# Altium schematic sheet 0042_PCH_PI_BOM.SchDoc
size 848 x 558 mm
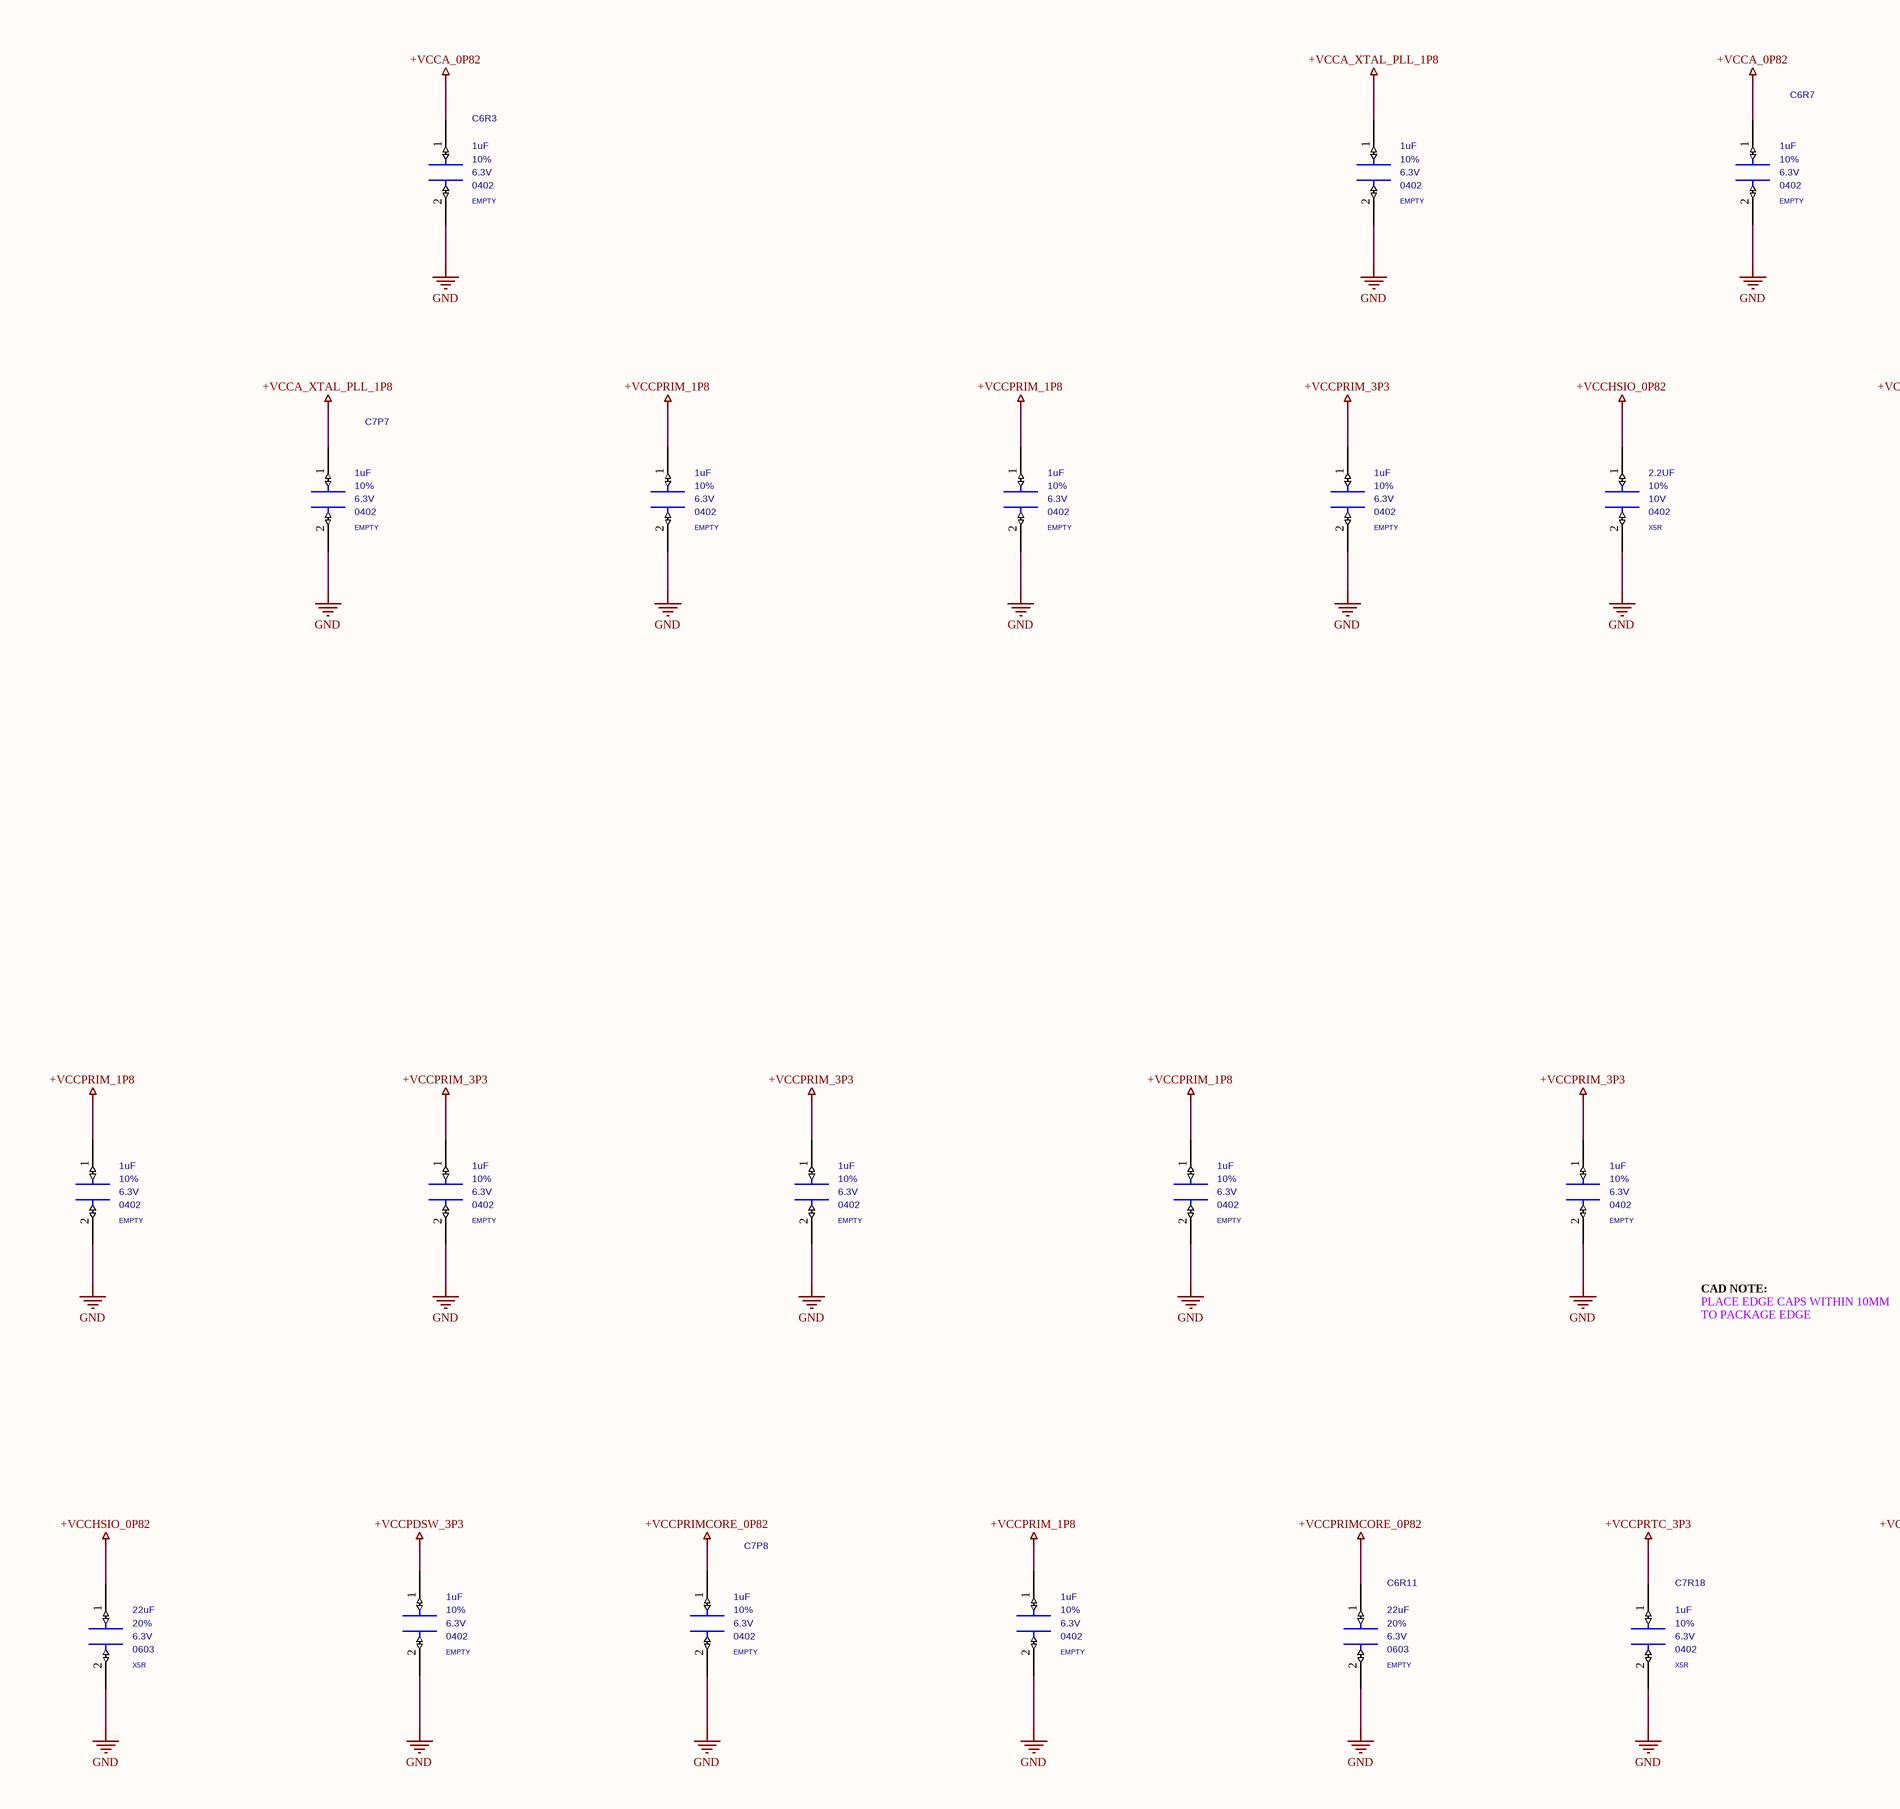
[diagram p0: 0042_PCH_PI_BOM.SchDoc, left]
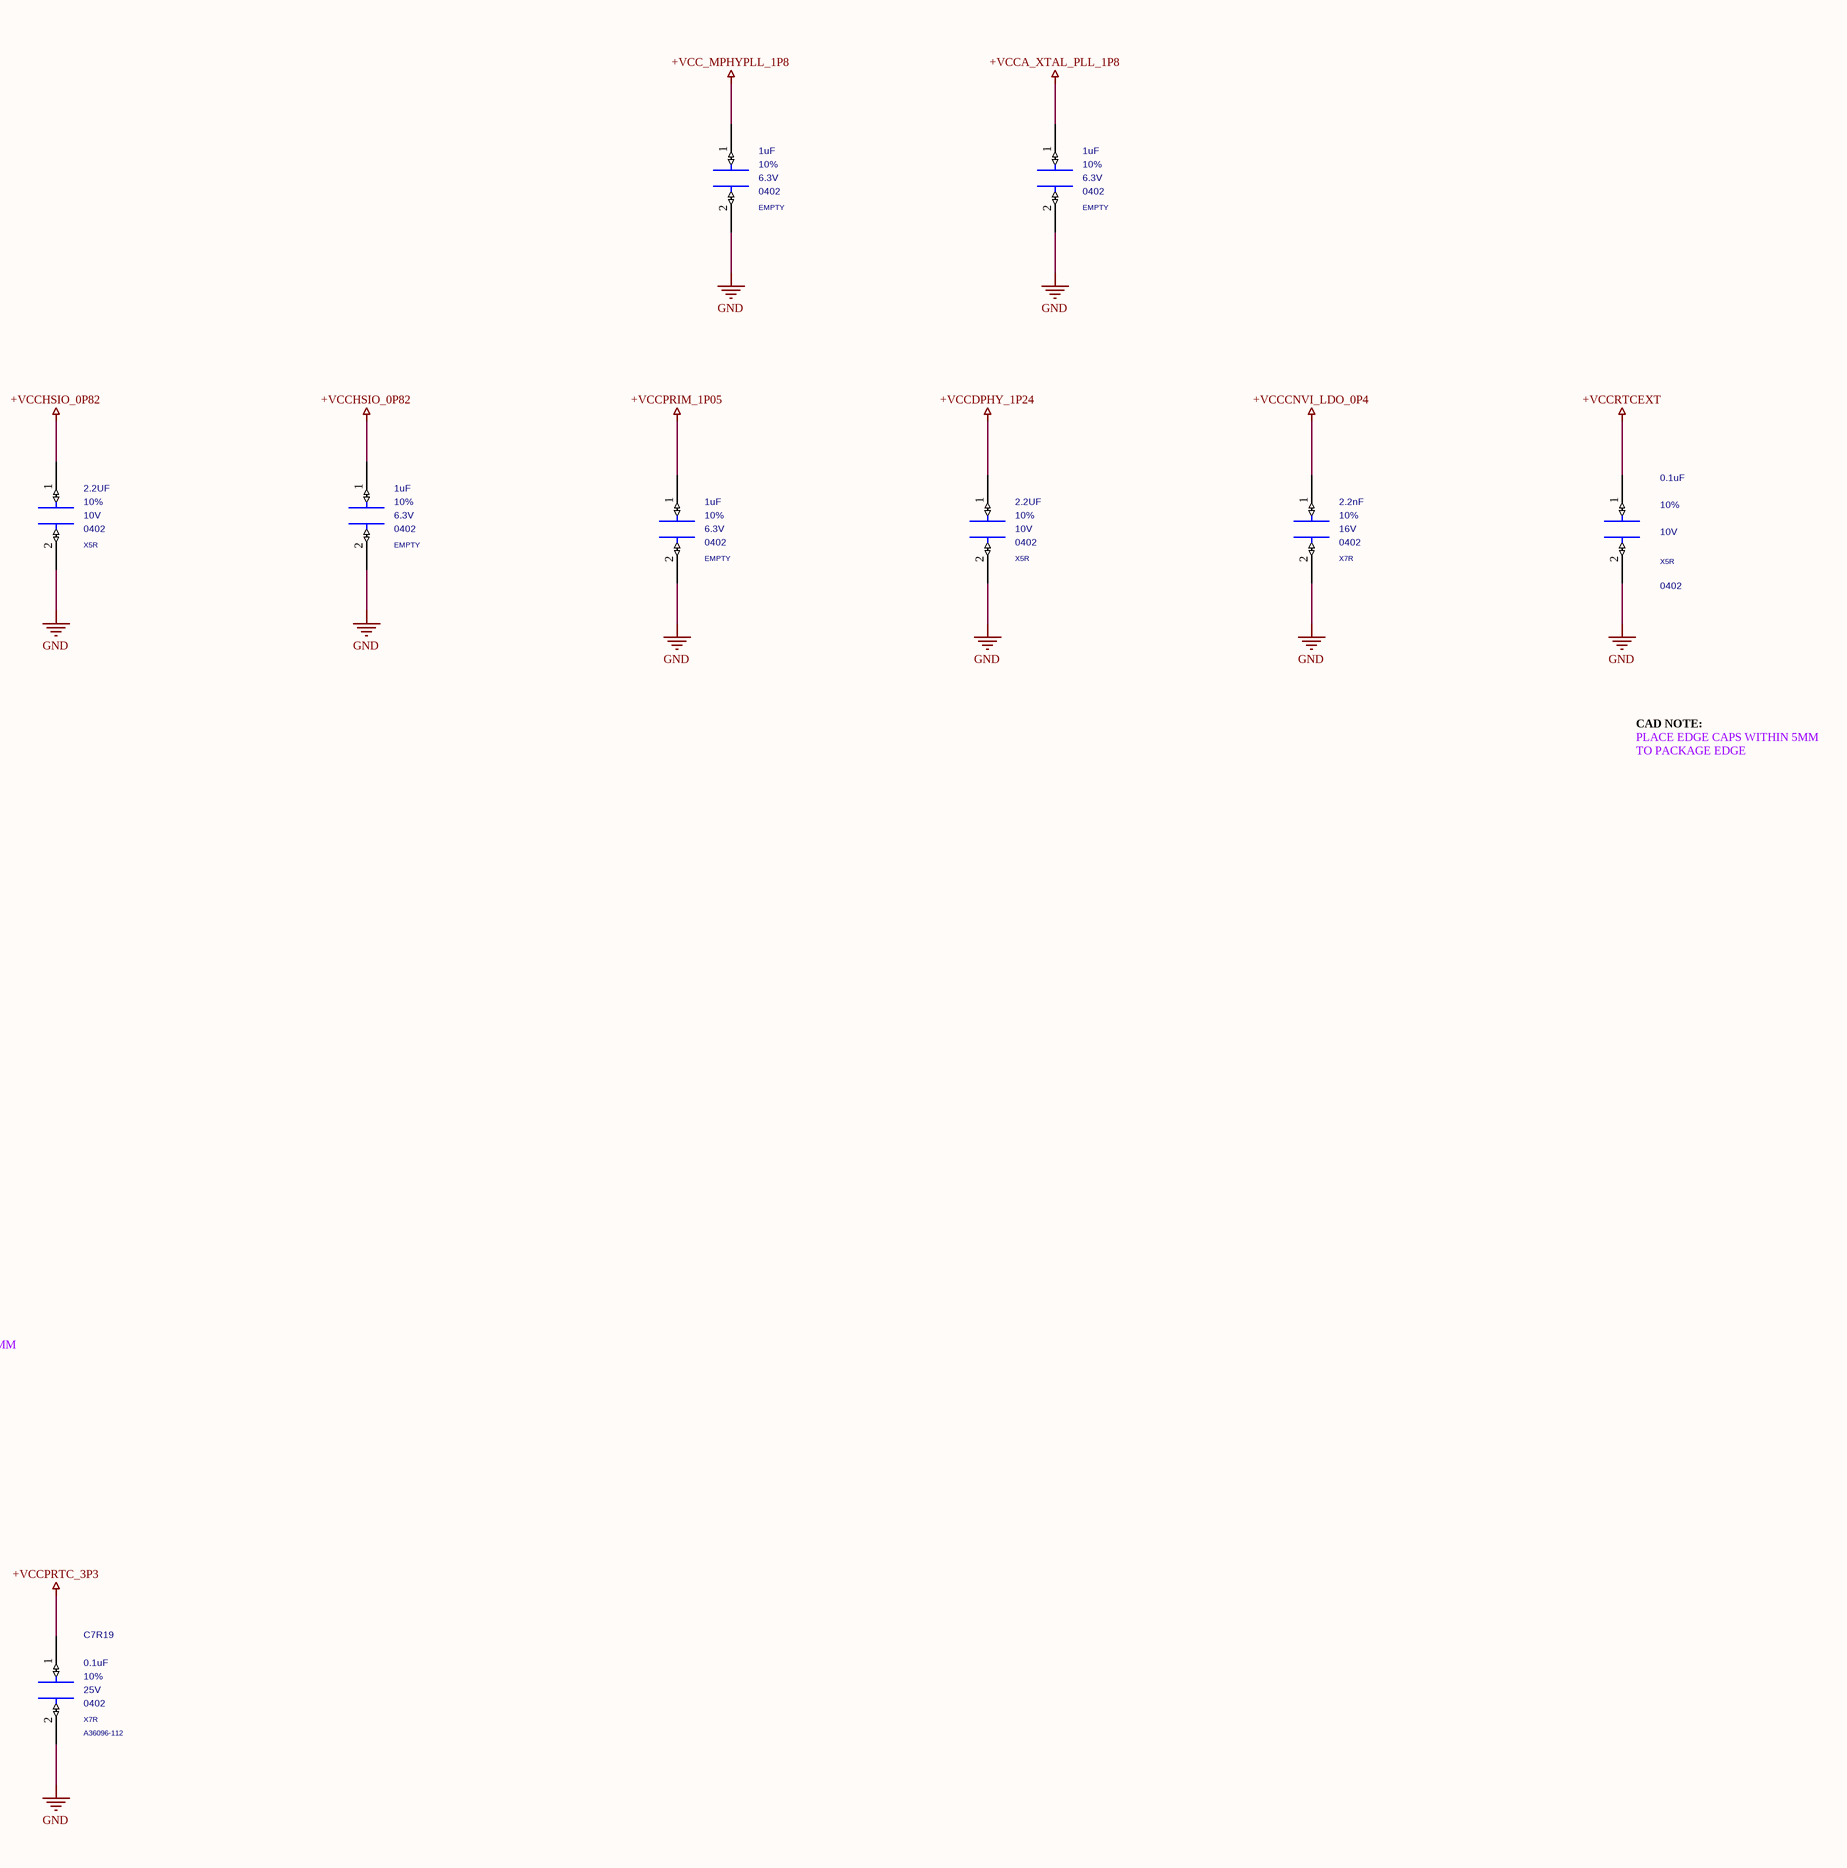
[diagram p1: 0042_PCH_PI_BOM.SchDoc, right]

## Parts
C6F1  2.2UF  MATERIAL: X5R  PACK_TYPE: 0402  TOLERANCE: 10%  VOLTAGE: 10V  [SMC0402IA]
C6F2  2.2UF  MATERIAL: X5R  PACK_TYPE: 0402  TOLERANCE: 10%  VOLTAGE: 10V  [SMC0402IA]
C6F3  22uF  MATERIAL: X5R  PACK_TYPE: 0603  TOLERANCE: 20%  VOLTAGE: 6.3V  [SMC0603ID]
C6R3  1uF  MATERIAL: EMPTY  PACK_TYPE: 0402  TOLERANCE: 10%  VOLTAGE: 6.3V  [SMC0402IA]
C6R7  1uF  MATERIAL: EMPTY  PACK_TYPE: 0402  TOLERANCE: 10%  VOLTAGE: 6.3V  [SMC0402IA]
C6R11  22uF  MATERIAL: EMPTY  PACK_TYPE: 0603  TOLERANCE: 20%  VOLTAGE: 6.3V  [SMC0603ID]
C7E1  2.2nF  MATERIAL: X7R  PACK_TYPE: 0402  TOLERANCE: 10%  VOLTAGE: 16V  [SMC0402IA]
C7F1  1uF  MATERIAL: EMPTY  PACK_TYPE: 0402  TOLERANCE: 10%  VOLTAGE: 6.3V  [SMC0402IA]
C7F2  0.1uF  MATERIAL: X5R  PACK_TYPE: 0402  TOLERANCE: 10%  VOLTAGE: 10V  [SMC0402IA]
C7P7  1uF  MATERIAL: EMPTY  PACK_TYPE: 0402  TOLERANCE: 10%  VOLTAGE: 6.3V  [SMC0402IA]
C7P8  1uF  MATERIAL: EMPTY  PACK_TYPE: 0402  TOLERANCE: 10%  VOLTAGE: 6.3V  [SMC0402IA]
C7R1  2.2UF  MATERIAL: X5R  PACK_TYPE: 0402  TOLERANCE: 10%  VOLTAGE: 10V  [SMC0402IA]
C7R2  1uF  MATERIAL: EMPTY  PACK_TYPE: 0402  TOLERANCE: 10%  VOLTAGE: 6.3V  [SMC0402IA]
C7R3  1uF  MATERIAL: EMPTY  PACK_TYPE: 0402  TOLERANCE: 10%  VOLTAGE: 6.3V  [SMC0402IA]
C7R4  1uF  MATERIAL: EMPTY  PACK_TYPE: 0402  TOLERANCE: 10%  VOLTAGE: 6.3V  [SMC0402IA]
C7R5  1uF  MATERIAL: EMPTY  PACK_TYPE: 0402  TOLERANCE: 10%  VOLTAGE: 6.3V  [SMC0402IA]
C7R6  1uF  MATERIAL: EMPTY  PACK_TYPE: 0402  TOLERANCE: 10%  VOLTAGE: 6.3V  [SMC0402IA]
C7R7  1uF  MATERIAL: EMPTY  PACK_TYPE: 0402  TOLERANCE: 10%  VOLTAGE: 6.3V  [SMC0402IA]
C7R8  1uF  MATERIAL: EMPTY  PACK_TYPE: 0402  TOLERANCE: 10%  VOLTAGE: 6.3V  [SMC0402IA]
C7R9  1uF  MATERIAL: EMPTY  PACK_TYPE: 0402  TOLERANCE: 10%  VOLTAGE: 6.3V  [SMC0402IA]
C7R10  1uF  MATERIAL: EMPTY  PACK_TYPE: 0402  TOLERANCE: 10%  VOLTAGE: 6.3V  [SMC0402IA]
C7R11  1uF  MATERIAL: EMPTY  PACK_TYPE: 0402  TOLERANCE: 10%  VOLTAGE: 6.3V  [SMC0402IA]
C7R12  1uF  MATERIAL: EMPTY  PACK_TYPE: 0402  TOLERANCE: 10%  VOLTAGE: 6.3V  [SMC0402IA]
C7R13  1uF  MATERIAL: EMPTY  PACK_TYPE: 0402  TOLERANCE: 10%  VOLTAGE: 6.3V  [SMC0402IA]
C7R14  1uF  MATERIAL: EMPTY  PACK_TYPE: 0402  TOLERANCE: 10%  VOLTAGE: 6.3V  [SMC0402IA]
C7R15  1uF  MATERIAL: EMPTY  PACK_TYPE: 0402  TOLERANCE: 10%  VOLTAGE: 6.3V  [SMC0402IA]
C7R18  1uF  MATERIAL: X5R  PACK_TYPE: 0402  TOLERANCE: 10%  VOLTAGE: 6.3V  [SMC0402IA]
C7R19  0.1uF  MATERIAL: X7R  PACK_TYPE: 0402  PART_NUMBER: A36096-112  TOLERANCE: 10%  VOLTAGE: 25V  [SMC0402IA]

## Nets
+VCC_MPHYPLL_1P8: C7R9.1(A)
+VCCA_0P82: C6R3.1(A) C6R7.1(A)
+VCCA_XTAL_PLL_1P8: C7P7.1(A) C7R5.1(A) C7R7.1(A)
+VCCCNVI_LDO_0P4: C7E1.1(A)
+VCCDPHY_1P24: C7R1.1(A)
+VCCHSIO_0P82: C6F1.1(A) C6F2.1(A) C6F3.1(A) C7R10.1(A)
+VCCPDSW_3P3: C7F1.1(A)
+VCCPRIM_1P05: C7R2.1(A)
+VCCPRIM_1P8: C7R3.1(A) C7R4.1(A) C7R6.1(A) C7R8.1(A) C7R11.1(A)
+VCCPRIM_3P3: C7R12.1(A) C7R13.1(A) C7R14.1(A) C7R15.1(A)
+VCCPRIMCORE_0P82: C6R11.1(A) C7P8.1(A)
+VCCPRTC_3P3: C7R18.1(A) C7R19.1(A)
+VCCRTCEXT: C7F2.1(A)
GND: C6F1.2(B) C6F2.2(B) C6F3.2(B) C6R3.2(B) C6R7.2(B) C6R11.2(B) C7E1.2(B) C7F1.2(B) C7F2.2(B) C7P7.2(B) C7P8.2(B) C7R1.2(B) C7R2.2(B) C7R3.2(B) C7R4.2(B) C7R5.2(B) C7R6.2(B) C7R7.2(B) C7R8.2(B) C7R9.2(B) C7R10.2(B) C7R11.2(B) C7R12.2(B) C7R13.2(B) C7R14.2(B) C7R15.2(B) C7R18.2(B) C7R19.2(B)

## Notes on the sheet
- CAD NOTE:
- TO PACKAGE EDGE
- PLACE EDGE CAPS WITHIN 5MM
- PLACE EDGE CAPS WITHIN 10MM

## Library data of the parts
C6F1 = CAP: PART_NUMBER: A36096-121; CDS_PHYS_PART_NAME: CAP_0402-A36096-121,X5R,2.2UF,10V,10%,LPDB,GENERIC; OriginalSymbolOrigin: (-50,25); XY: (-12700,3475); VER: 1; ROT: 0; PHYS_PAGE: 42; LOCATION: C6F1; IP: GENERIC; FP_TECH: LPDB; DRAWING: @RVP1_ADL_SB_ADP_S_DDR5_SODIMM_2DPC_LIB.H55_DG2_2DPC(SCH_1):PAGE42; CDS_LIB: discrete; PCB Footprint: SMC0402IA; SEC_TYPE: 0402; CHIPS_PART_NAME: CAP; CDS_PART_NAME: CAP_0402-A36096-121,X5R,2.2UF,10V,10%,LPDB,GENERIC; CDS_LOCATION: C6F1; ASI_MODEL: A36096-121
C6F2 = CAP: PART_NUMBER: A36096-121; CDS_PHYS_PART_NAME: CAP_0402-A36096-121,X5R,2.2UF,10V,10%,LPDB,GENERIC; OriginalSymbolOrigin: (-50,25); XY: (-12125,3475); VER: 1; ROT: 0; PHYS_PAGE: 42; LOCATION: C6F2; IP: GENERIC; FP_TECH: LPDB; DRAWING: @RVP1_ADL_SB_ADP_S_DDR5_SODIMM_2DPC_LIB.H55_DG2_2DPC(SCH_1):PAGE42; CDS_LIB: discrete; PCB Footprint: SMC0402IA; SEC_TYPE: 0402; CHIPS_PART_NAME: CAP; CDS_PART_NAME: CAP_0402-A36096-121,X5R,2.2UF,10V,10%,LPDB,GENERIC; CDS_LOCATION: C6F2; ASI_MODEL: A36096-121
C6F3 = CAP: PART_NUMBER: 602433-081; CDS_PHYS_PART_NAME: CAP_0603-602433-081,X5R,22UF,6.3V,20%,LPDB,GENERIC; OriginalSymbolOrigin: (-50,25); XY: (-15600,1300); VER: 1; ROT: 0; PHYS_PAGE: 42; LOCATION: C6F3; IP: GENERIC; FP_TECH: LPDB; FIN: VREG_CPU_DCPL; DRAWING: @RVP1_ADL_SB_ADP_S_DDR5_SODIMM_2DPC_LIB.H55_DG2_2DPC(SCH_1):PAGE42; CDS_LIB: discrete; BOM: CORE_VREG_CPU; PCB Footprint: SMC0603ID; SEC_TYPE: 0603; CHIPS_PART_NAME: CAP; CDS_PART_NAME: CAP_0603-602433-081,X5R,22UF,6.3V,20%,LPDB,GENERIC; CDS_LOCATION: C6F3; ASI_MODEL: 602433-081
C6R3 = CAP: PART_NUMBER: A36096-027; CDS_PHYS_PART_NAME: CAP_0402-A36096-027,EMPTY,1UF,6.3V,10%,LPDB,GENERIC; OriginalSymbolOrigin: (-50,25); XY: (-14950,4100); VER: 1; ROT: 0; PHYS_PAGE: 42; LOCATION: C6R3; IP: GENERIC; FP_TECH: LPDB; DRAWING: @RVP1_ADL_SB_ADP_S_DDR5_SODIMM_2DPC_LIB.H55_DG2_2DPC(SCH_1):PAGE42; CDS_LIB: discrete; PCB Footprint: SMC0402IA; SEC_TYPE: 0402; CHIPS_PART_NAME: CAP; CDS_PART_NAME: CAP_0402-A36096-027,EMPTY,1UF,6.3V,10%,LPDB,GENERIC; CDS_LOCATION: C6R3; ASI_MODEL: A36096-027
C6R7 = CAP: PART_NUMBER: A36096-027; CDS_PHYS_PART_NAME: CAP_0402-A36096-027,EMPTY,1UF,6.3V,10%,LPDB,GENERIC; OriginalSymbolOrigin: (-50,25); XY: (-12450,4100); VER: 1; ROT: 0; PHYS_PAGE: 42; LOCATION: C6R7; IP: GENERIC; FP_TECH: LPDB; DRAWING: @RVP1_ADL_SB_ADP_S_DDR5_SODIMM_2DPC_LIB.H55_DG2_2DPC(SCH_1):PAGE42; CDS_LIB: discrete; PCB Footprint: SMC0402IA; SEC_TYPE: 0402; CHIPS_PART_NAME: CAP; CDS_PART_NAME: CAP_0402-A36096-027,EMPTY,1UF,6.3V,10%,LPDB,GENERIC; CDS_LOCATION: C6R7; ASI_MODEL: A36096-027
C6R11 = CAP: PART_NUMBER: 602433-081; CDS_PHYS_PART_NAME: CAP_0603-602433-081,EMPTY,22UF,6.3V,20%,LPDB,GENERIC; OriginalSymbolOrigin: (-50,25); XY: (-13200,1300); VER: 1; ROT: 0; PHYS_PAGE: 42; LOCATION: C6R11; IP: GENERIC; FP_TECH: LPDB; FIN: VREG_CPU_DCPL; DRAWING: @RVP1_ADL_SB_ADP_S_DDR5_SODIMM_2DPC_LIB.H55_DG2_2DPC(SCH_1):PAGE42; CDS_LIB: discrete; BOM: CORE_VREG_CPU; PCB Footprint: SMC0603ID; SEC_TYPE: 0603; CHIPS_PART_NAME: CAP; CDS_PART_NAME: CAP_0603-602433-081,EMPTY,22UF,6.3V,20%,LPDB,GENERIC; CDS_LOCATION: C6R11; ASI_MODEL: 602433-081
C7E1 = CAP: PART_NUMBER: A36096-157; CDS_PHYS_PART_NAME: CAP_0402-A36096-157,X7R,2.2NF,16V,10%,LPDB,GENERIC; OriginalSymbolOrigin: (-50,25); XY: (-9800,3450); VER: 1; ROT: 0; PHYS_PAGE: 42; LOCATION: C7E1; IP: GENERIC; FP_TECH: LPDB; DRAWING: @RVP1_ADL_SB_ADP_S_DDR5_SODIMM_2DPC_LIB.H55_DG2_2DPC(SCH_1):PAGE42; CDS_LIB: discrete; PCB Footprint: SMC0402IA; SEC_TYPE: 0402; CHIPS_PART_NAME: CAP; CDS_PART_NAME: CAP_0402-A36096-157,X7R,2.2NF,16V,10%,LPDB,GENERIC; CDS_LOCATION: C7E1; ASI_MODEL: A36096-157
C7F1 = CAP: PART_NUMBER: A36096-027; CDS_PHYS_PART_NAME: CAP_0402-A36096-027,EMPTY,1UF,6.3V,10%,LPDB,GENERIC; OriginalSymbolOrigin: (-50,25); XY: (-15000,1325); VER: 1; ROT: 0; PHYS_PAGE: 42; LOCATION: C7F1; IP: GENERIC; FP_TECH: LPDB; DRAWING: @RVP1_ADL_SB_ADP_S_DDR5_SODIMM_2DPC_LIB.H55_DG2_2DPC(SCH_1):PAGE42; CDS_LIB: discrete; PCB Footprint: SMC0402IA; SEC_TYPE: 0402; CHIPS_PART_NAME: CAP; CDS_PART_NAME: CAP_0402-A36096-027,EMPTY,1UF,6.3V,10%,LPDB,GENERIC; CDS_LOCATION: C7F1; ASI_MODEL: A36096-027
C7F2 = CAP: PART_NUMBER: A36096-009; CDS_PHYS_PART_NAME: CAP_0402-A36096-009,X5R,0.1UF,10V,10%,LPDB,GENERIC; OriginalSymbolOrigin: (-50,25); XY: (-9225,3450); VER: 1; ROT: 0; PHYS_PAGE: 42; LOCATION: C7F2; IP: GENERIC; FP_TECH: LPDB; DRAWING: @RVP1_ADL_SB_ADP_S_DDR5_SODIMM_2DPC_LIB.H55_DG2_2DPC(SCH_1):PAGE42; CDS_LIB: discrete; PCB Footprint: SMC0402IA; SEC_TYPE: 0402; CHIPS_PART_NAME: CAP; CDS_PART_NAME: CAP_0402-A36096-009,X5R,0.1UF,10V,10%,LPDB,GENERIC; CDS_LOCATION: C7F2; ASI_MODEL: A36096-009
C7P7 = CAP: PART_NUMBER: A36096-027; CDS_PHYS_PART_NAME: CAP_0402-A36096-027,EMPTY,1UF,6.3V,10%,LPDB,GENERIC; OriginalSymbolOrigin: (-50,25); XY: (-15175,3475); VER: 1; ROT: 0; PHYS_PAGE: 42; LOCATION: C7P7; IP: GENERIC; FP_TECH: LPDB; DRAWING: @RVP1_ADL_SB_ADP_S_DDR5_SODIMM_2DPC_LIB.H55_DG2_2DPC(SCH_1):PAGE42; CDS_LIB: discrete; PCB Footprint: SMC0402IA; SEC_TYPE: 0402; CHIPS_PART_NAME: CAP; CDS_PART_NAME: CAP_0402-A36096-027,EMPTY,1UF,6.3V,10%,LPDB,GENERIC; CDS_LOCATION: C7P7; ASI_MODEL: A36096-027
C7P8 = CAP: PART_NUMBER: A36096-027; CDS_PHYS_PART_NAME: CAP_0402-A36096-027,EMPTY,1UF,6.3V,10%,LPDB,GENERIC; OriginalSymbolOrigin: (-50,25); XY: (-14450,1325); VER: 1; ROT: 0; PHYS_PAGE: 42; LOCATION: C7P8; IP: GENERIC; FP_TECH: LPDB; DRAWING: @RVP1_ADL_SB_ADP_S_DDR5_SODIMM_2DPC_LIB.H55_DG2_2DPC(SCH_1):PAGE42; CDS_LIB: discrete; PCB Footprint: SMC0402IA; SEC_TYPE: 0402; CHIPS_PART_NAME: CAP; CDS_PART_NAME: CAP_0402-A36096-027,EMPTY,1UF,6.3V,10%,LPDB,GENERIC; CDS_LOCATION: C7P8; ASI_MODEL: A36096-027
C7R1 = CAP: PART_NUMBER: A36096-121; CDS_PHYS_PART_NAME: CAP_0402-A36096-121,X5R,2.2UF,10V,10%,LPDB,GENERIC; OriginalSymbolOrigin: (-50,25); XY: (-10400,3450); VER: 1; ROT: 0; PHYS_PAGE: 42; LOCATION: C7R1; IP: GENERIC; FP_TECH: LPDB; DRAWING: @RVP1_ADL_SB_ADP_S_DDR5_SODIMM_2DPC_LIB.H55_DG2_2DPC(SCH_1):PAGE42; CDS_LIB: discrete; PCB Footprint: SMC0402IA; SEC_TYPE: 0402; CHIPS_PART_NAME: CAP; CDS_PART_NAME: CAP_0402-A36096-121,X5R,2.2UF,10V,10%,LPDB,GENERIC; CDS_LOCATION: C7R1; ASI_MODEL: A36096-121
C7R2 = CAP: PART_NUMBER: A36096-027; CDS_PHYS_PART_NAME: CAP_0402-A36096-027,EMPTY,1UF,6.3V,10%,LPDB,GENERIC; OriginalSymbolOrigin: (-50,25); XY: (-10975,3450); VER: 1; ROT: 0; PHYS_PAGE: 42; LOCATION: C7R2; IP: GENERIC; FP_TECH: LPDB; DRAWING: @RVP1_ADL_SB_ADP_S_DDR5_SODIMM_2DPC_LIB.H55_DG2_2DPC(SCH_1):PAGE42; CDS_LIB: discrete; PCB Footprint: SMC0402IA; CHIPS_PART_NAME: CAP; CDS_PART_NAME: CAP_0402-A36096-027,EMPTY,1UF,6.3V,10%,LPDB,GENERIC; CDS_LOCATION: C7R2; ASI_MODEL: A36096-027
C7R3 = CAP: PART_NUMBER: A36096-027; CDS_PHYS_PART_NAME: CAP_0402-A36096-027,EMPTY,1UF,6.3V,10%,LPDB,GENERIC; OriginalSymbolOrigin: (-50,25); XY: (-13825,1325); VER: 1; ROT: 0; PHYS_PAGE: 42; LOCATION: C7R3; IP: GENERIC; FP_TECH: LPDB; DRAWING: @RVP1_ADL_SB_ADP_S_DDR5_SODIMM_2DPC_LIB.H55_DG2_2DPC(SCH_1):PAGE42; CDS_LIB: discrete; PCB Footprint: SMC0402IA; SEC_TYPE: 0402; CHIPS_PART_NAME: CAP; CDS_PART_NAME: CAP_0402-A36096-027,EMPTY,1UF,6.3V,10%,LPDB,GENERIC; CDS_LOCATION: C7R3; ASI_MODEL: A36096-027
C7R4 = CAP: PART_NUMBER: A36096-027; CDS_PHYS_PART_NAME: CAP_0402-A36096-027,EMPTY,1UF,6.3V,10%,LPDB,GENERIC; OriginalSymbolOrigin: (-50,25); XY: (-13525,2150); VER: 1; ROT: 0; PHYS_PAGE: 42; LOCATION: C7R4; IP: GENERIC; FP_TECH: LPDB; DRAWING: @RVP1_ADL_SB_ADP_S_DDR5_SODIMM_2DPC_LIB.H55_DG2_2DPC(SCH_1):PAGE42; CDS_LIB: discrete; PCB Footprint: SMC0402IA; SEC_TYPE: 0402; CHIPS_PART_NAME: CAP; CDS_PART_NAME: CAP_0402-A36096-027,EMPTY,1UF,6.3V,10%,LPDB,GENERIC; CDS_LOCATION: C7R4; ASI_MODEL: A36096-027
C7R5 = CAP: PART_NUMBER: A36096-027; CDS_PHYS_PART_NAME: CAP_0402-A36096-027,EMPTY,1UF,6.3V,10%,LPDB,GENERIC; OriginalSymbolOrigin: (-50,25); XY: (-13175,4100); VER: 1; ROT: 0; PHYS_PAGE: 42; LOCATION: C7R5; IP: GENERIC; FP_TECH: LPDB; DRAWING: @RVP1_ADL_SB_ADP_S_DDR5_SODIMM_2DPC_LIB.H55_DG2_2DPC(SCH_1):PAGE42; CDS_LIB: discrete; PCB Footprint: SMC0402IA; SEC_TYPE: 0402; CHIPS_PART_NAME: CAP; CDS_PART_NAME: CAP_0402-A36096-027,EMPTY,1UF,6.3V,10%,LPDB,GENERIC; CDS_LOCATION: C7R5; ASI_MODEL: A36096-027
C7R6 = CAP: PART_NUMBER: A36096-027; CDS_PHYS_PART_NAME: CAP_0402-A36096-027,EMPTY,1UF,6.3V,10%,LPDB,GENERIC; OriginalSymbolOrigin: (-50,25); XY: (-13850,3475); VER: 1; ROT: 0; PHYS_PAGE: 42; LOCATION: C7R6; IP: GENERIC; FP_TECH: LPDB; DRAWING: @RVP1_ADL_SB_ADP_S_DDR5_SODIMM_2DPC_LIB.H55_DG2_2DPC(SCH_1):PAGE42; CDS_LIB: discrete; PCB Footprint: SMC0402IA; SEC_TYPE: 0402; CHIPS_PART_NAME: CAP; CDS_PART_NAME: CAP_0402-A36096-027,EMPTY,1UF,6.3V,10%,LPDB,GENERIC; CDS_LOCATION: C7R6; ASI_MODEL: A36096-027
C7R7 = CAP: PART_NUMBER: A36096-027; CDS_PHYS_PART_NAME: CAP_0402-A36096-027,EMPTY,1UF,6.3V,10%,LPDB,GENERIC; OriginalSymbolOrigin: (-50,25); XY: (-10275,4100); VER: 1; ROT: 0; PHYS_PAGE: 42; LOCATION: C7R7; IP: GENERIC; FP_TECH: LPDB; DRAWING: @RVP1_ADL_SB_ADP_S_DDR5_SODIMM_2DPC_LIB.H55_DG2_2DPC(SCH_1):PAGE42; CDS_LIB: discrete; PCB Footprint: SMC0402IA; SEC_TYPE: 0402; CHIPS_PART_NAME: CAP; CDS_PART_NAME: CAP_0402-A36096-027,EMPTY,1UF,6.3V,10%,LPDB,GENERIC; CDS_LOCATION: C7R7; ASI_MODEL: A36096-027
C7R8 = CAP: PART_NUMBER: A36096-027; CDS_PHYS_PART_NAME: CAP_0402-A36096-027,EMPTY,1UF,6.3V,10%,LPDB,GENERIC; OriginalSymbolOrigin: (-50,25); XY: (-14525,3475); VER: 1; ROT: 0; PHYS_PAGE: 42; LOCATION: C7R8; IP: GENERIC; FP_TECH: LPDB; DRAWING: @RVP1_ADL_SB_ADP_S_DDR5_SODIMM_2DPC_LIB.H55_DG2_2DPC(SCH_1):PAGE42; CDS_LIB: discrete; PCB Footprint: SMC0402IA; CHIPS_PART_NAME: CAP; CDS_PART_NAME: CAP_0402-A36096-027,EMPTY,1UF,6.3V,10%,LPDB,GENERIC; CDS_LOCATION: C7R8; ASI_MODEL: A36096-027
C7R9 = CAP: PART_NUMBER: A36096-027; CDS_PHYS_PART_NAME: CAP_0402-A36096-027,EMPTY,1UF,6.3V,10%,LPDB,GENERIC; OriginalSymbolOrigin: (-50,25); XY: (-10875,4100); VER: 1; ROT: 0; PHYS_PAGE: 42; LOCATION: C7R9; IP: GENERIC; FP_TECH: LPDB; DRAWING: @RVP1_ADL_SB_ADP_S_DDR5_SODIMM_2DPC_LIB.H55_DG2_2DPC(SCH_1):PAGE42; CDS_LIB: discrete; PCB Footprint: SMC0402IA; SEC_TYPE: 0402; CHIPS_PART_NAME: CAP; CDS_PART_NAME: CAP_0402-A36096-027,EMPTY,1UF,6.3V,10%,LPDB,GENERIC; CDS_LOCATION: C7R9; ASI_MODEL: A36096-027
C7R10 = CAP: PART_NUMBER: A36096-027; CDS_PHYS_PART_NAME: CAP_0402-A36096-027,EMPTY,1UF,6.3V,10%,LPDB,GENERIC; OriginalSymbolOrigin: (-50,25); XY: (-11550,3475); VER: 1; ROT: 0; PHYS_PAGE: 42; LOCATION: C7R10; IP: GENERIC; FP_TECH: LPDB; DRAWING: @RVP1_ADL_SB_ADP_S_DDR5_SODIMM_2DPC_LIB.H55_DG2_2DPC(SCH_1):PAGE42; CDS_LIB: discrete; PCB Footprint: SMC0402IA; CHIPS_PART_NAME: CAP; CDS_PART_NAME: CAP_0402-A36096-027,EMPTY,1UF,6.3V,10%,LPDB,GENERIC; CDS_LOCATION: C7R10; ASI_MODEL: A36096-027
C7R11 = CAP: PART_NUMBER: A36096-027; CDS_PHYS_PART_NAME: CAP_0402-A36096-027,EMPTY,1UF,6.3V,10%,LPDB,GENERIC; OriginalSymbolOrigin: (-50,25); XY: (-15625,2150); VER: 1; ROT: 0; PHYS_PAGE: 42; LOCATION: C7R11; IP: GENERIC; FP_TECH: LPDB; DRAWING: @RVP1_ADL_SB_ADP_S_DDR5_SODIMM_2DPC_LIB.H55_DG2_2DPC(SCH_1):PAGE42; CDS_LIB: discrete; PCB Footprint: SMC0402IA; SEC_TYPE: 0402; CHIPS_PART_NAME: CAP; CDS_PART_NAME: CAP_0402-A36096-027,EMPTY,1UF,6.3V,10%,LPDB,GENERIC; CDS_LOCATION: C7R11; ASI_MODEL: A36096-027
C7R12 = CAP: PART_NUMBER: A36096-027; CDS_PHYS_PART_NAME: CAP_0402-A36096-027,EMPTY,1UF,6.3V,10%,LPDB,GENERIC; OriginalSymbolOrigin: (-50,25); XY: (-12775,2150); VER: 1; ROT: 0; PHYS_PAGE: 42; LOCATION: C7R12; IP: GENERIC; FP_TECH: LPDB; DRAWING: @RVP1_ADL_SB_ADP_S_DDR5_SODIMM_2DPC_LIB.H55_DG2_2DPC(SCH_1):PAGE42; CDS_LIB: discrete; PCB Footprint: SMC0402IA; SEC_TYPE: 0402; CHIPS_PART_NAME: CAP; CDS_PART_NAME: CAP_0402-A36096-027,EMPTY,1UF,6.3V,10%,LPDB,GENERIC; CDS_LOCATION: C7R12; ASI_MODEL: A36096-027
C7R13 = CAP: PART_NUMBER: A36096-027; CDS_PHYS_PART_NAME: CAP_0402-A36096-027,EMPTY,1UF,6.3V,10%,LPDB,GENERIC; OriginalSymbolOrigin: (-50,25); XY: (-14250,2150); VER: 1; ROT: 0; PHYS_PAGE: 42; LOCATION: C7R13; IP: GENERIC; FP_TECH: LPDB; DRAWING: @RVP1_ADL_SB_ADP_S_DDR5_SODIMM_2DPC_LIB.H55_DG2_2DPC(SCH_1):PAGE42; CDS_LIB: discrete; PCB Footprint: SMC0402IA; SEC_TYPE: 0402; CHIPS_PART_NAME: CAP; CDS_PART_NAME: CAP_0402-A36096-027,EMPTY,1UF,6.3V,10%,LPDB,GENERIC; CDS_LOCATION: C7R13; ASI_MODEL: A36096-027
C7R14 = CAP: PART_NUMBER: A36096-027; CDS_PHYS_PART_NAME: CAP_0402-A36096-027,EMPTY,1UF,6.3V,10%,LPDB,GENERIC; OriginalSymbolOrigin: (-50,25); XY: (-14950,2150); VER: 1; ROT: 0; PHYS_PAGE: 42; LOCATION: C7R14; IP: GENERIC; FP_TECH: LPDB; DRAWING: @RVP1_ADL_SB_ADP_S_DDR5_SODIMM_2DPC_LIB.H55_DG2_2DPC(SCH_1):PAGE42; CDS_LIB: discrete; PCB Footprint: SMC0402IA; SEC_TYPE: 0402; CHIPS_PART_NAME: CAP; CDS_PART_NAME: CAP_0402-A36096-027,EMPTY,1UF,6.3V,10%,LPDB,GENERIC; CDS_LOCATION: C7R14; ASI_MODEL: A36096-027
C7R15 = CAP: PART_NUMBER: A36096-027; CDS_PHYS_PART_NAME: CAP_0402-A36096-027,EMPTY,1UF,6.3V,10%,LPDB,GENERIC; OriginalSymbolOrigin: (-50,25); XY: (-13225,3475); VER: 1; ROT: 0; PHYS_PAGE: 42; LOCATION: C7R15; IP: GENERIC; FP_TECH: LPDB; DRAWING: @RVP1_ADL_SB_ADP_S_DDR5_SODIMM_2DPC_LIB.H55_DG2_2DPC(SCH_1):PAGE42; CDS_LIB: discrete; PCB Footprint: SMC0402IA; CHIPS_PART_NAME: CAP; CDS_PART_NAME: CAP_0402-A36096-027,EMPTY,1UF,6.3V,10%,LPDB,GENERIC; CDS_LOCATION: C7R15; ASI_MODEL: A36096-027
C7R18 = CAP: PART_NUMBER: A36096-027; CDS_PHYS_PART_NAME: CAP_0402-A36096-027,X5R,1UF,6.3V,10%,LPDB,GENERIC; OriginalSymbolOrigin: (-50,25); XY: (-12650,1300); VER: 1; ROT: 0; PHYS_PAGE: 42; LOCATION: C7R18; IP: GENERIC; FP_TECH: LPDB; FIN: GLUE; DRAWING: @RVP1_ADL_SB_ADP_S_DDR5_SODIMM_2DPC_LIB.H55_DG2_2DPC(SCH_1):PAGE42; CDS_LIB: discrete; PCB Footprint: SMC0402IA; CHIPS_PART_NAME: CAP; CDS_PART_NAME: CAP_0402-A36096-027,X5R,1UF,6.3V,10%,LPDB,GENERIC; CDS_LOCATION: C7R18; ASI_MODEL: A36096-027
C7R19 = CAP: CDS_PHYS_PART_NAME: CAP_0402-A36096-112,X7R,0.1UF,25V,10%,LPDB,GENERIC; OriginalSymbolOrigin: (-50,25); XY: (-12125,1300); VER: 1; ROT: 0; PHYS_PAGE: 42; LOCATION: C7R19; IP: GENERIC; FP_TECH: LPDB; FIN: VREG_V_CPU_CORE; DRAWING: @RVP1_ADL_SB_ADP_S_DDR5_SODIMM_2DPC_LIB.H55_DG2_2DPC(SCH_1):PAGE42; CDS_LIB: discrete; PCB Footprint: SMC0402IA; CHIPS_PART_NAME: CAP; CDS_PART_NAME: CAP_0402-A36096-112,X7R,0.1UF,25V,10%,LPDB,GENERIC; CDS_LOCATION: C7R19; ASI_MODEL: A36096-112